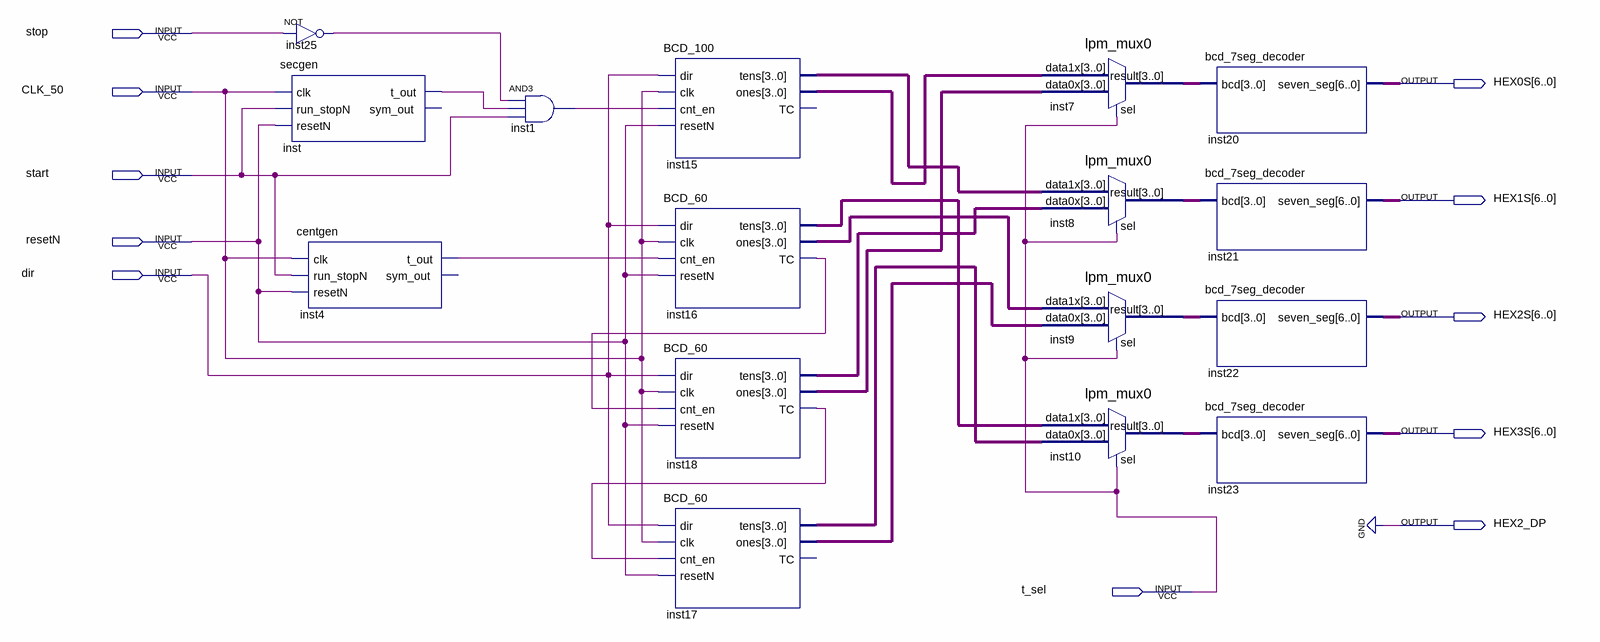
[diagram p0: schematic sheet]
// Quartus schematic test.bdf as structural Verilog: 16 symbols, 11 pins
module test (
  input  stop,
  input  CLK_50,
  input  start,
  input  resetN,
  input  dir,
  input  t_sel,
  output [6:0] HEX0S,
  output [6:0] HEX1S,
  output [6:0] HEX2S,
  output [6:0] HEX3S,
  output HEX2_DP
);

  wire inst1_out, inst4_t_out, inst16_tc, inst18_tc, inst25_out, inst_t_out;
  wire [3:0] inst7_result, inst8_result, inst9_result, inst10_result, inst15_ones, inst15_tens, inst16_ones,
       inst16_tens, inst17_ones, inst17_tens, inst18_ones, inst18_tens;

  not inst25 (inst25_out, stop);
  secgen inst (.clk(CLK_50), .run_stopN(start), .resetN(resetN), .t_out(inst_t_out));  // open: sym_out
  centgen inst4 (.clk(CLK_50), .run_stopN(start), .resetN(resetN), .t_out(inst4_t_out));  // open: sym_out
  and inst1 (inst1_out, inst25_out, inst_t_out, start);
  BCD_100 inst15 (
    .dir(dir), .clk(CLK_50), .cnt_en(inst1_out), .resetN(resetN), .tens(inst15_tens), .ones(inst15_ones));  // open: TC
  BCD_60 inst16 (
    .dir(dir), .clk(CLK_50), .cnt_en(inst4_t_out), .resetN(resetN), .tens(inst16_tens), .ones(inst16_ones),
    .TC(inst16_tc));
  BCD_60 inst18 (
    .dir(dir), .clk(CLK_50), .cnt_en(inst16_tc), .resetN(resetN), .tens(inst18_tens), .ones(inst18_ones),
    .TC(inst18_tc));
  BCD_60 inst17 (
    .dir(dir), .clk(CLK_50), .cnt_en(inst18_tc), .resetN(resetN), .tens(inst17_tens), .ones(inst17_ones));  // open: TC
  lpm_mux0 inst7 (.data1x(inst15_ones), .data0x(inst18_ones), .sel(t_sel), .result(inst7_result));
  lpm_mux0 inst8 (.data1x(inst15_tens), .data0x(inst18_tens), .sel(t_sel), .result(inst8_result));
  lpm_mux0 inst9 (.data1x(inst16_ones), .data0x(inst17_ones), .sel(t_sel), .result(inst9_result));
  lpm_mux0 inst10 (.data1x(inst16_tens), .data0x(inst17_tens), .sel(t_sel), .result(inst10_result));
  bcd_7seg_decoder inst20 (.bcd(inst7_result), .seven_seg(HEX0S));
  bcd_7seg_decoder inst21 (.bcd(inst8_result), .seven_seg(HEX1S));
  bcd_7seg_decoder inst22 (.bcd(inst9_result), .seven_seg(HEX2S));
  bcd_7seg_decoder inst23 (.bcd(inst10_result), .seven_seg(HEX3S));

  assign HEX2_DP = 1'b0;
endmodule
